# EAGLE design TriangleBoardPressureConnector (EAGLE 9.6.1)
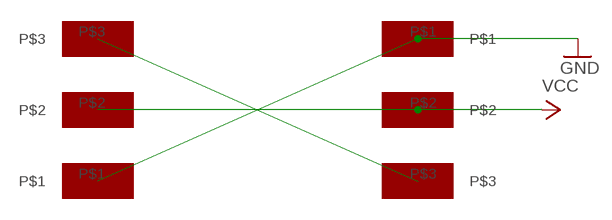
[diagram p0: schematic, sheet 1]

## Parts
U$1  3_CONTACT_PADS_5_MM_SPACING_WITH_HOLES  [RECTANGULAR_PADS_5_MM_SPACING_WITH_HOLES]
U$2  3_CONTACT_PADS_5_MM_SPACING_WITH_HOLES  [RECTANGULAR_PADS_5_MM_SPACING_WITH_HOLES]

## Nets
GND: U$1.P$1 U$2.P$1
N$1: U$1.P$3 U$2.P$3
VCC: U$1.P$2 U$2.P$2

## Library data of the parts
U$1 U$2 = debra:3_CONTACT_PADS_5_MM_SPACING_WITH_HOLES

## Board
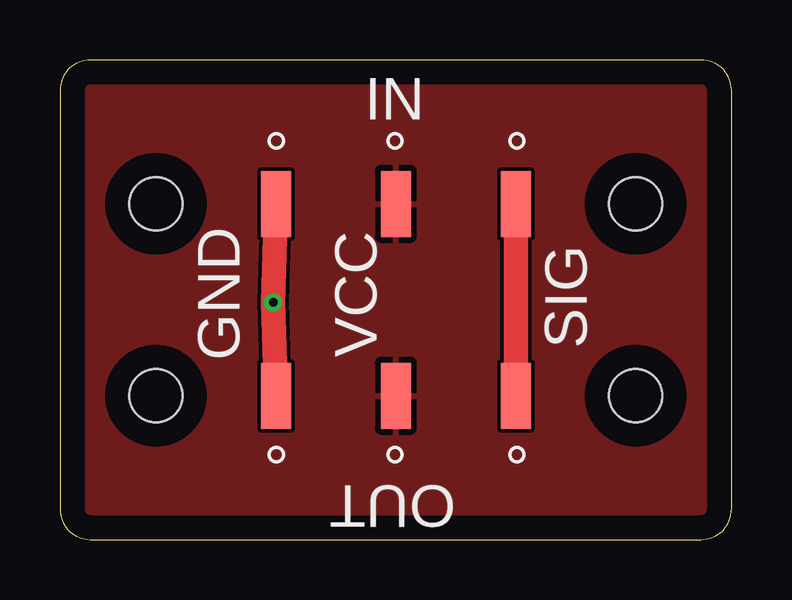
[diagram p1: board, top side]
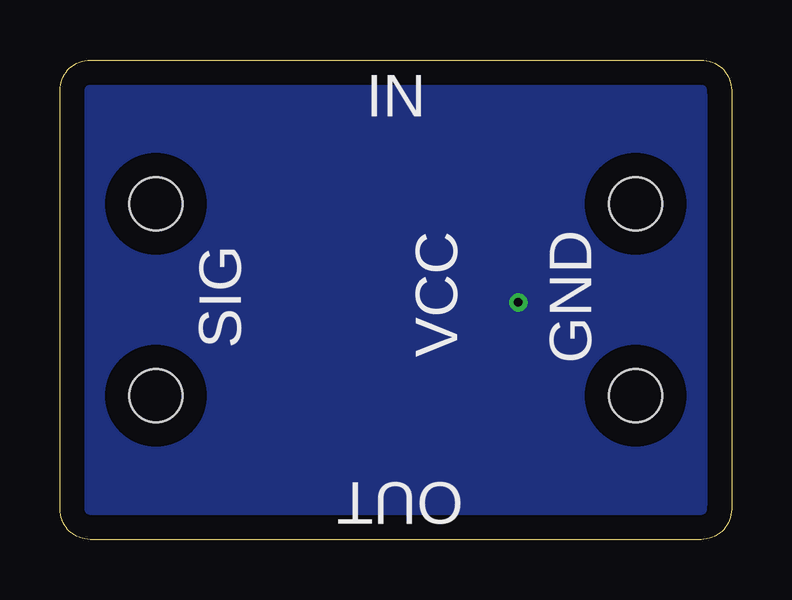
[diagram p2: board, bottom side, seen from below]

Size 28 x 20 mm. Coordinates in mm from the lower left corner, seen from the top.
Outline: 1.27,0 26.73,0 arc90 28,1.27 28,18.73 arc90 26.73,20 1.27,20 arc90 0,18.73 0,1.27 arc90 1.27,0
Copper layers (1*16): Top 0.035mm / dielectric 1.5mm / Bottom 0.035mm
Design rules "default *": minimum track width 6mil, minimum drill 0.35mm, track to track 6mil, track to pad 6mil, pad to pad 6mil, via to via 6mil, smd to smd 6mil, copper to edge 40mil, drill to drill 6mil, minimum pad ring 10mil, minimum via ring 8mil, stop-mask expansion 4mil, vias tented up to drill 16mil, thermal gap 10mil

### Footprints (pad centres in the part's own frame; a part is rotated, then mirrored left to right if it is on the bottom)
RECTANGULAR_PADS_5_MM_SPACING_WITH_HOLES = smd 1.25 x 2.75: P$1 -5,0; P$2 0,0; P$3 5,0 | hole 2.2: -10,0; 10,0

### Placement (x,y rotation side)
U$1  14,6 0 top
U$2  14,14 0 top

### Tracks (layer width: path | path; a pad name or v marks a point on that pad's centre or on a via)
GND  (via drill 0.35)
  Top 1.016: U$2.P$1 v8.89,9.89 U$1.P$1
  pour Bottom: -2.54,-0.27 -2.54,21.32 29.21,21.32 29.21,-0.27
N$1
  Top 1.016: U$2.P$3 U$1.P$3
VCC
  pour Top: -2.54,21.32 -2.54,-0.27 29.21,-0.27 29.21,21.32

### Text on the board
tPlace: IN | VCC | SIG | GND | OUT
bPlace: IN | VCC | SIG | GND | OUT